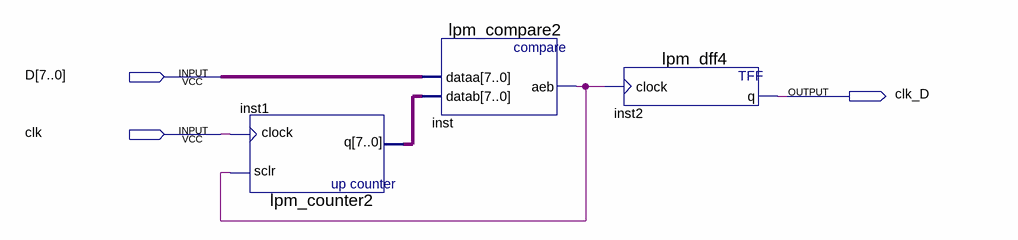
[diagram p0: schematic sheet]
// Quartus schematic Devider_BASE_1114.bdf as structural Verilog: 3 symbols, 3 pins
module Devider_BASE_1114 (
  input  [7:0] D,
  input  clk,
  output clk_D
);

  wire inst_aeb;
  wire [7:0] inst1_q;

  lpm_counter2 inst1 (.sclr(inst_aeb), .clock(clk), .q(inst1_q));
  lpm_compare2 inst (.dataa(D), .datab(inst1_q), .aeb(inst_aeb));
  lpm_dff4 inst2 (.clock(inst_aeb), .q(clk_D));
endmodule
